# EAGLE design voltageregulators (EAGLE 9.0.0)
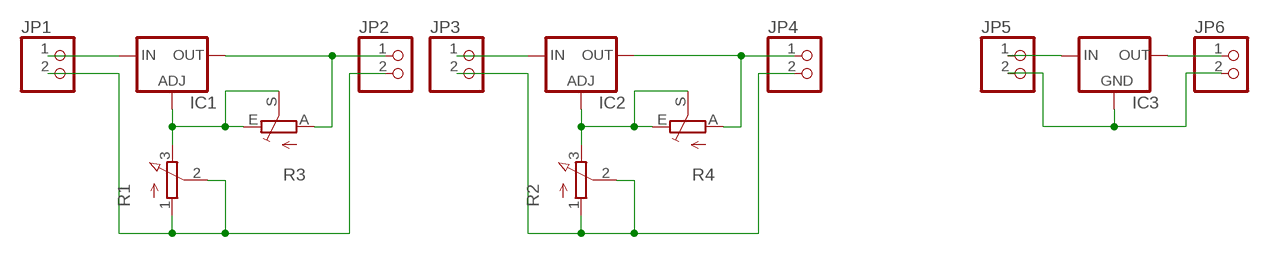
[diagram p0: schematic, sheet 1]

## Parts
IC1  LM317TS  [317TS]
IC2  LM317TS  [317TS]
IC3  78XXS  [78XXS]
JP1  PINHD-1X2  [1X02]
JP2  PINHD-1X2  [1X02]
JP3  PINHD-1X2  [1X02]
JP4  PINHD-1X2  [1X02]
JP5  PINHD-1X2  [1X02]
JP6  PINHD-1X2  [1X02]
R1  3RP/1610N  [3RP/1610N]
R2  3RP/1610N  [3RP/1610N]
R3  TRIM_EU-LI10  [LI10]
R4  TRIM_EU-LI10  [LI10]

## Nets
GND: JP1.2 JP2.2 R1.1(A) R1.2(S)
GND2: JP3.2 JP4.2 R2.1(A) R2.2(S)
GND3: IC3.GND JP5.2 JP6.2
N$1: IC3.IN JP5.1
N$2: IC3.OUT JP6.1
N$4: IC1.1(ADJ) R1.3(E) R3.E R3.S
N$5: IC1.3(IN) JP1.1
N$6: IC1.2(OUT) JP2.1 R3.A
N$11: IC2.3(IN) JP3.1
N$12: IC2.1(ADJ) R2.3(E) R4.E R4.S
N$14: IC2.2(OUT) JP4.1 R4.A

## Library data of the parts
IC1 IC2 = v-reg:LM317TS: VOLTAGE REGULATOR
IC3 = v-reg:78XXS: VOLTAGE REGULATOR
JP1-JP6 = pinhead:PINHD-1X2: PIN HEADER
R1 R2 = pot:3RP/1610N: 16mm Potentiometer one level Source: http://www.alphapotentiometers.net/html/16mm_pot_2.html
R3 R4 = pot:TRIM_EU-: POTENTIOMETER

## Board
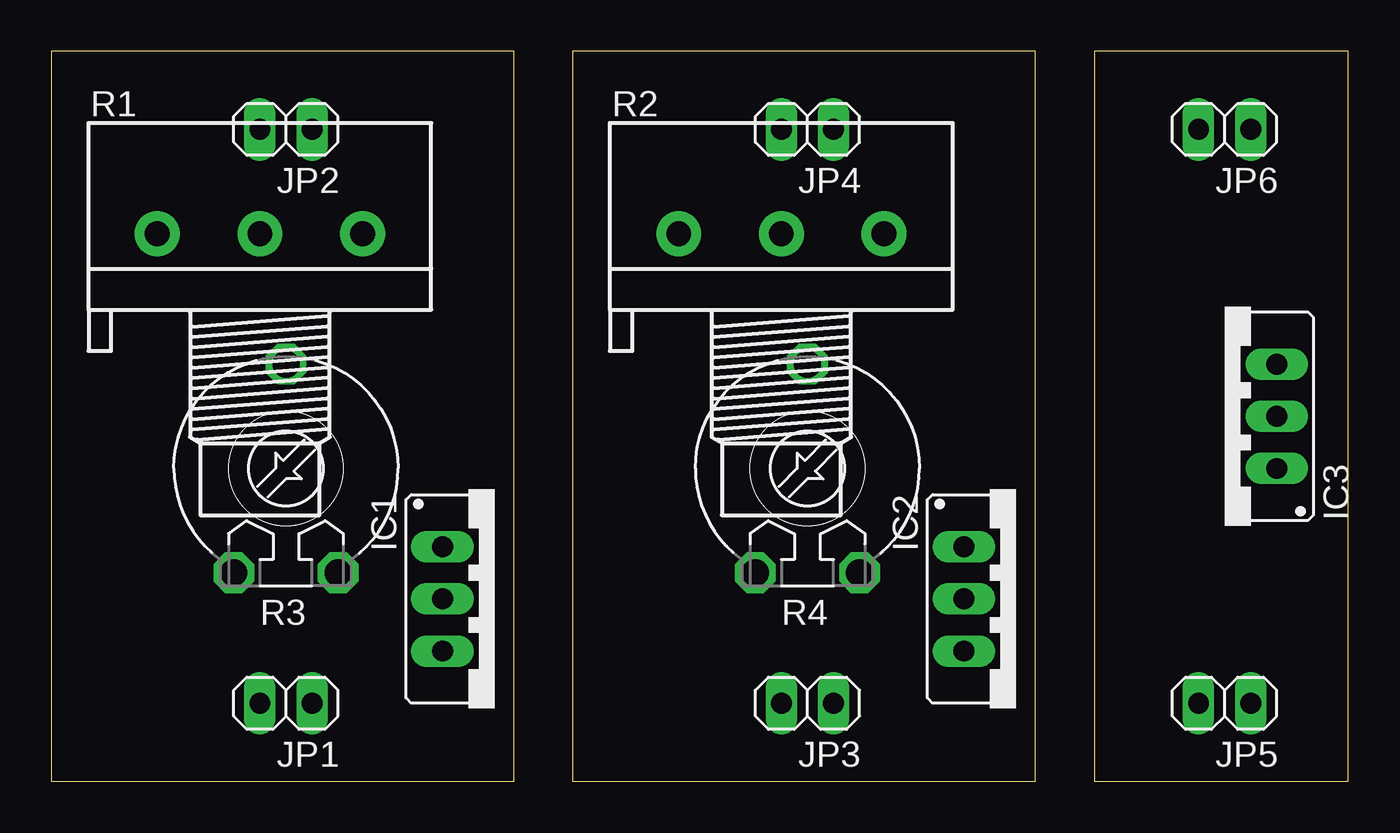
[diagram p1: board, top side]
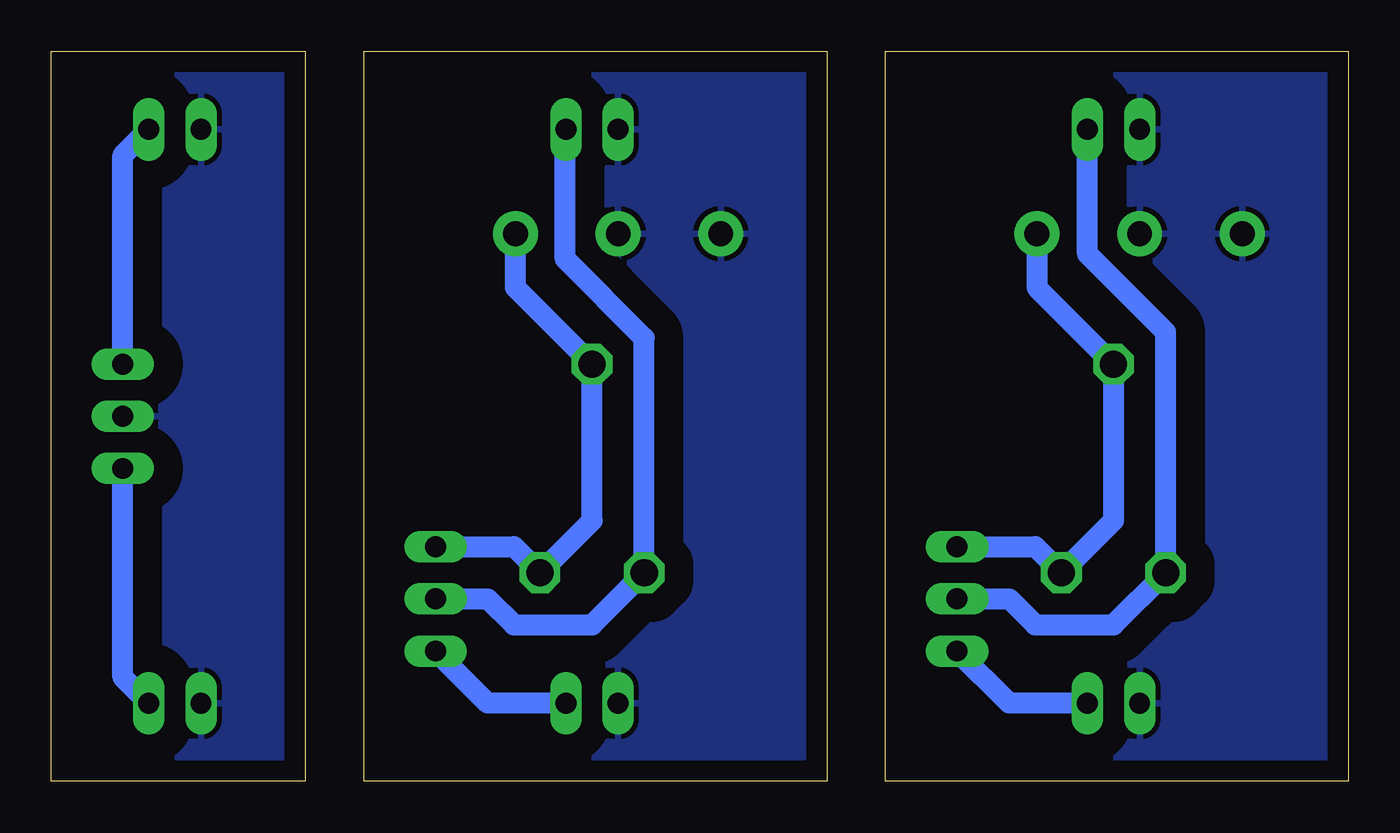
[diagram p2: board, bottom side, seen from below]

Size 63.17 x 35.55 mm. Coordinates in mm from the lower left corner, seen from the top.
Outline: 0,0 22.53,0 22.53,35.55 0,35.55 0,0
Outline: 25.4,0 47.93,0 47.93,35.55 25.4,35.55 25.4,0
Outline: 50.8,0 63.17,0 63.17,35.55 50.8,35.55 50.8,0
Copper layers (1*16): Top 0.035mm / dielectric 1.5mm / Bottom 0.035mm
Design rules "default *": minimum track width 6mil, minimum drill 0.35mm, track to track 1.4mm, track to pad 0.4mm, pad to pad 6mil, via to via 6mil, smd to smd 6mil, copper to edge 40mil, drill to drill 6mil, minimum pad ring 10mil, minimum via ring 8mil, stop-mask expansion 4mil, vias tented up to drill 0mil, thermal gap 10mil

### Footprints (pad centres in the part's own frame; a part is rotated, then mirrored left to right if it is on the bottom)
317TS = drill 1.016 long: 1 -2.54,-2.54; 2 0,-2.54; 3 2.54,-2.54
78XXS = drill 1.016 long: GND 0,-2.54; IN -2.54,-2.54; OUT 2.54,-2.54
1X02 = drill 1.016 long: 1 -1.27,0; 2 1.27,0
3RP/1610N = drill 1.2 pad 2.184: 1 -5,0; 2 0,0; 3 5,0
LI10 = drill 1.321 octagon: A -2.54,-5.08; E 2.54,-5.08; S 0,5.08

### Placement (x,y rotation side)
IC1  21.59,8.89 270 top
IC2  46.99,8.89 270 top
IC3  57.15,17.78 90 top
JP1  11.43,3.81 180 top
JP2  11.43,31.75 180 top
JP3  36.83,3.81 180 top
JP4  36.83,31.75 180 top
JP5  57.15,3.81 180 top
JP6  57.15,31.75 180 top
R1  10.16,26.67 0 top
R2  35.56,26.67 0 top
R3  11.43,15.24 0 top
R4  36.83,15.24 0 top

### Tracks (layer width: path | path; a pad name or v marks a point on that pad's centre or on a via)
GND
  pour Bottom: 20.32,35.56 20.32,0 0,0 0,35.56
GND2
  pour Bottom: 45.72,35.56 45.72,0 25.4,0 25.4,35.56
GND3
  pour Bottom: 60.96,35.56 60.96,0 50.8,0 50.8,35.56
N$1
  Bottom 1.016: JP5.1 59.69,5.08 IC3.IN
N$2
  Bottom 1.016: IC3.OUT 59.69,30.48 JP6.1
N$4
  Bottom 1.016: IC1.1 15.24,11.43 R3.E 11.43,12.7 R3.S 15.16,24.05 R1.3
N$5
  Bottom 1.016: JP1.1 16.51,3.81 IC1.3
N$6
  Bottom 1.016: IC1.2 16.51,8.89 15.24,7.62 11.43,7.62 R3.A 8.89,21.88 12.7,25.69 JP2.1
N$11
  Bottom 1.016: JP3.1 41.91,3.81 IC2.3
N$12
  Bottom 1.016: IC2.1 40.64,11.43 R4.E 36.83,12.7 R4.S 40.56,24.05 R2.3
N$14
  Bottom 1.016: IC2.2 41.91,8.89 40.64,7.62 36.83,7.62 R4.A 34.29,21.59 38.14,25.44 38.14,31.71 JP4.1